# Altium schematic sheet BATTERY_CHARGE_SCH.SchDoc
size A0
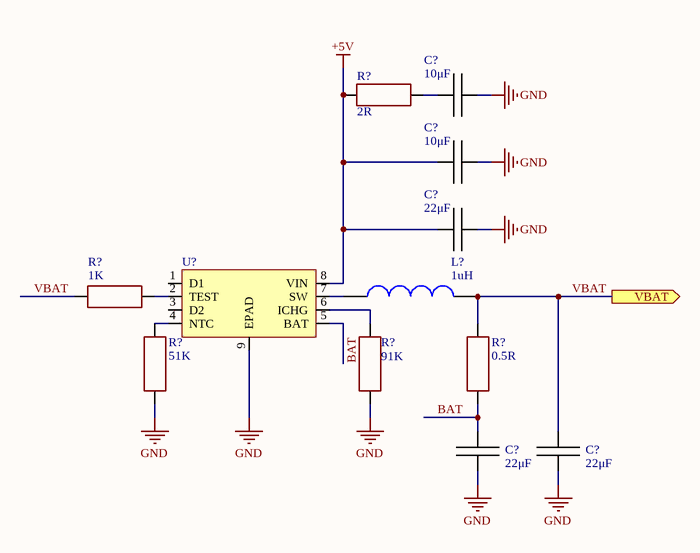
[diagram p0: BATTERY_CHARGE_SCH.SchDoc]

## Parts
(Parts that share a designator on the sheet are numbered #1, #2 ... from top to bottom, then left to right.)
C?#1  value 10μF  [CAP: 0603]  (hidden comment: Cap_0603)
C?#2  value 10μF  [CAP: 0603]  (hidden comment: Cap_0603)
C?#3  value 22μF  [CAP: 0603]  (hidden comment: Cap_0603)
C?#4  value 22μF  [CAP: 0603]  (hidden comment: Cap_0603)
C?#5  value 22μF  [CAP: 0603]  (hidden comment: Cap_0603)
L?  value 1uH  [CDRH74]  (hidden comment: CDRH74)
R?#1  value 2R  [RES: 0603]  (hidden comment: Resistor_0603)
R?#2  value 1K  [RES: 0603]  (hidden comment: Resistor_0603)
R?#3  value 91K  [RES: 0603]  (hidden comment: Resistor_0603)
R?#4  value 51K  [RES: 0603]  (hidden comment: Resistor_0603)
R?#5  value 0.5R  [RES: 0603]  (hidden comment: Resistor_0603)
U?  IP2312  [ESOP-8]  (value not drawn)

## Ports
VBAT (out)

## Nets
+5V: C?#2.2 C?#3.2 R?#1.1 U?.8(VIN)
GND: C?#1.1 C?#2.1 C?#3.1 C?#4.2 C?#5.2 R?#3.2 R?#4.1 U?.9(EPAD)
BAT: C?#4.1 R?#5.1 U?.5(BAT)
VBAT: C?#5.1 L?.1 R?#2.1 R?#5.2 ; port VBAT
NetC?#1_2: C?#1.2 R?#1.2
NetL?_2: L?.2 U?.7(SW)
NetR?#2_2: R?#2.2 U?.2(TEST)
NetR?#3_1: R?#3.1 U?.6(ICHG)
NetR?#4_2: R?#4.2 U?.4(NTC)

Not connected (* = marked no-connect by the designer): U? 1(D1) 3(D2)

## Library data of the parts
C?#1-C?#5 = Cap_0603: TypeDielectric: X7R(X5R); Voltage: 25V; Package/Case: 0603; Temperature: -55...+125°C(-55...+85°C); Product Category: Capacitors
L? = CDRH74: SMD Power Inductor; Manufacturer: SUMIDA; Datasheet: https://radiokomponent.com.ua/pdf/trans/CDRH74.pdf; HelpURL: https://aliexpress.ru/item/1005004321960425.html?sku_id=12000028751500104&spm=a2g2w.productlist.search_results.7.529b6cc4mPaVds; Product Category: Inductors
R?#1-R?#5 = Resistor_0603: Tolerance: ±5%; Package/Case: 0603; Temperature: -55...+125°C; Product Category: Resistors
U? = IP2312: Charge Module; Manufacturer: INJOINIC; Datasheet: https://datasheet.lcsc.com/lcsc/2304140030_INJOINIC-IP2312-4V35_C605433.pdf; HelpURL: https://aliexpress.ru/item/1005006314271382.html?spm=a2g2w.favourites.mywishlist.41.12044aa670bhdZ&sku_id=12000036725210626; Package/Case: ESOP-8; Product Category: Charge Modules